# Altium schematic sheet POWR0008_BCR_System.SchDoc: BLUEsat Battery Charge Regulator System
size A3; Engineer: Thomas Fisk; Organization: BLUEsat Project; Address1: Room 419; Address2: School of EE&T; Address3: UNSW, NSW 2052; Address4: Australia; DocumentNumber: POWR0008; SheetNumber: 1; SheetTotal: 1; Description: Controls charging of batteries, MPPT, provides telem data; Version: 2.0
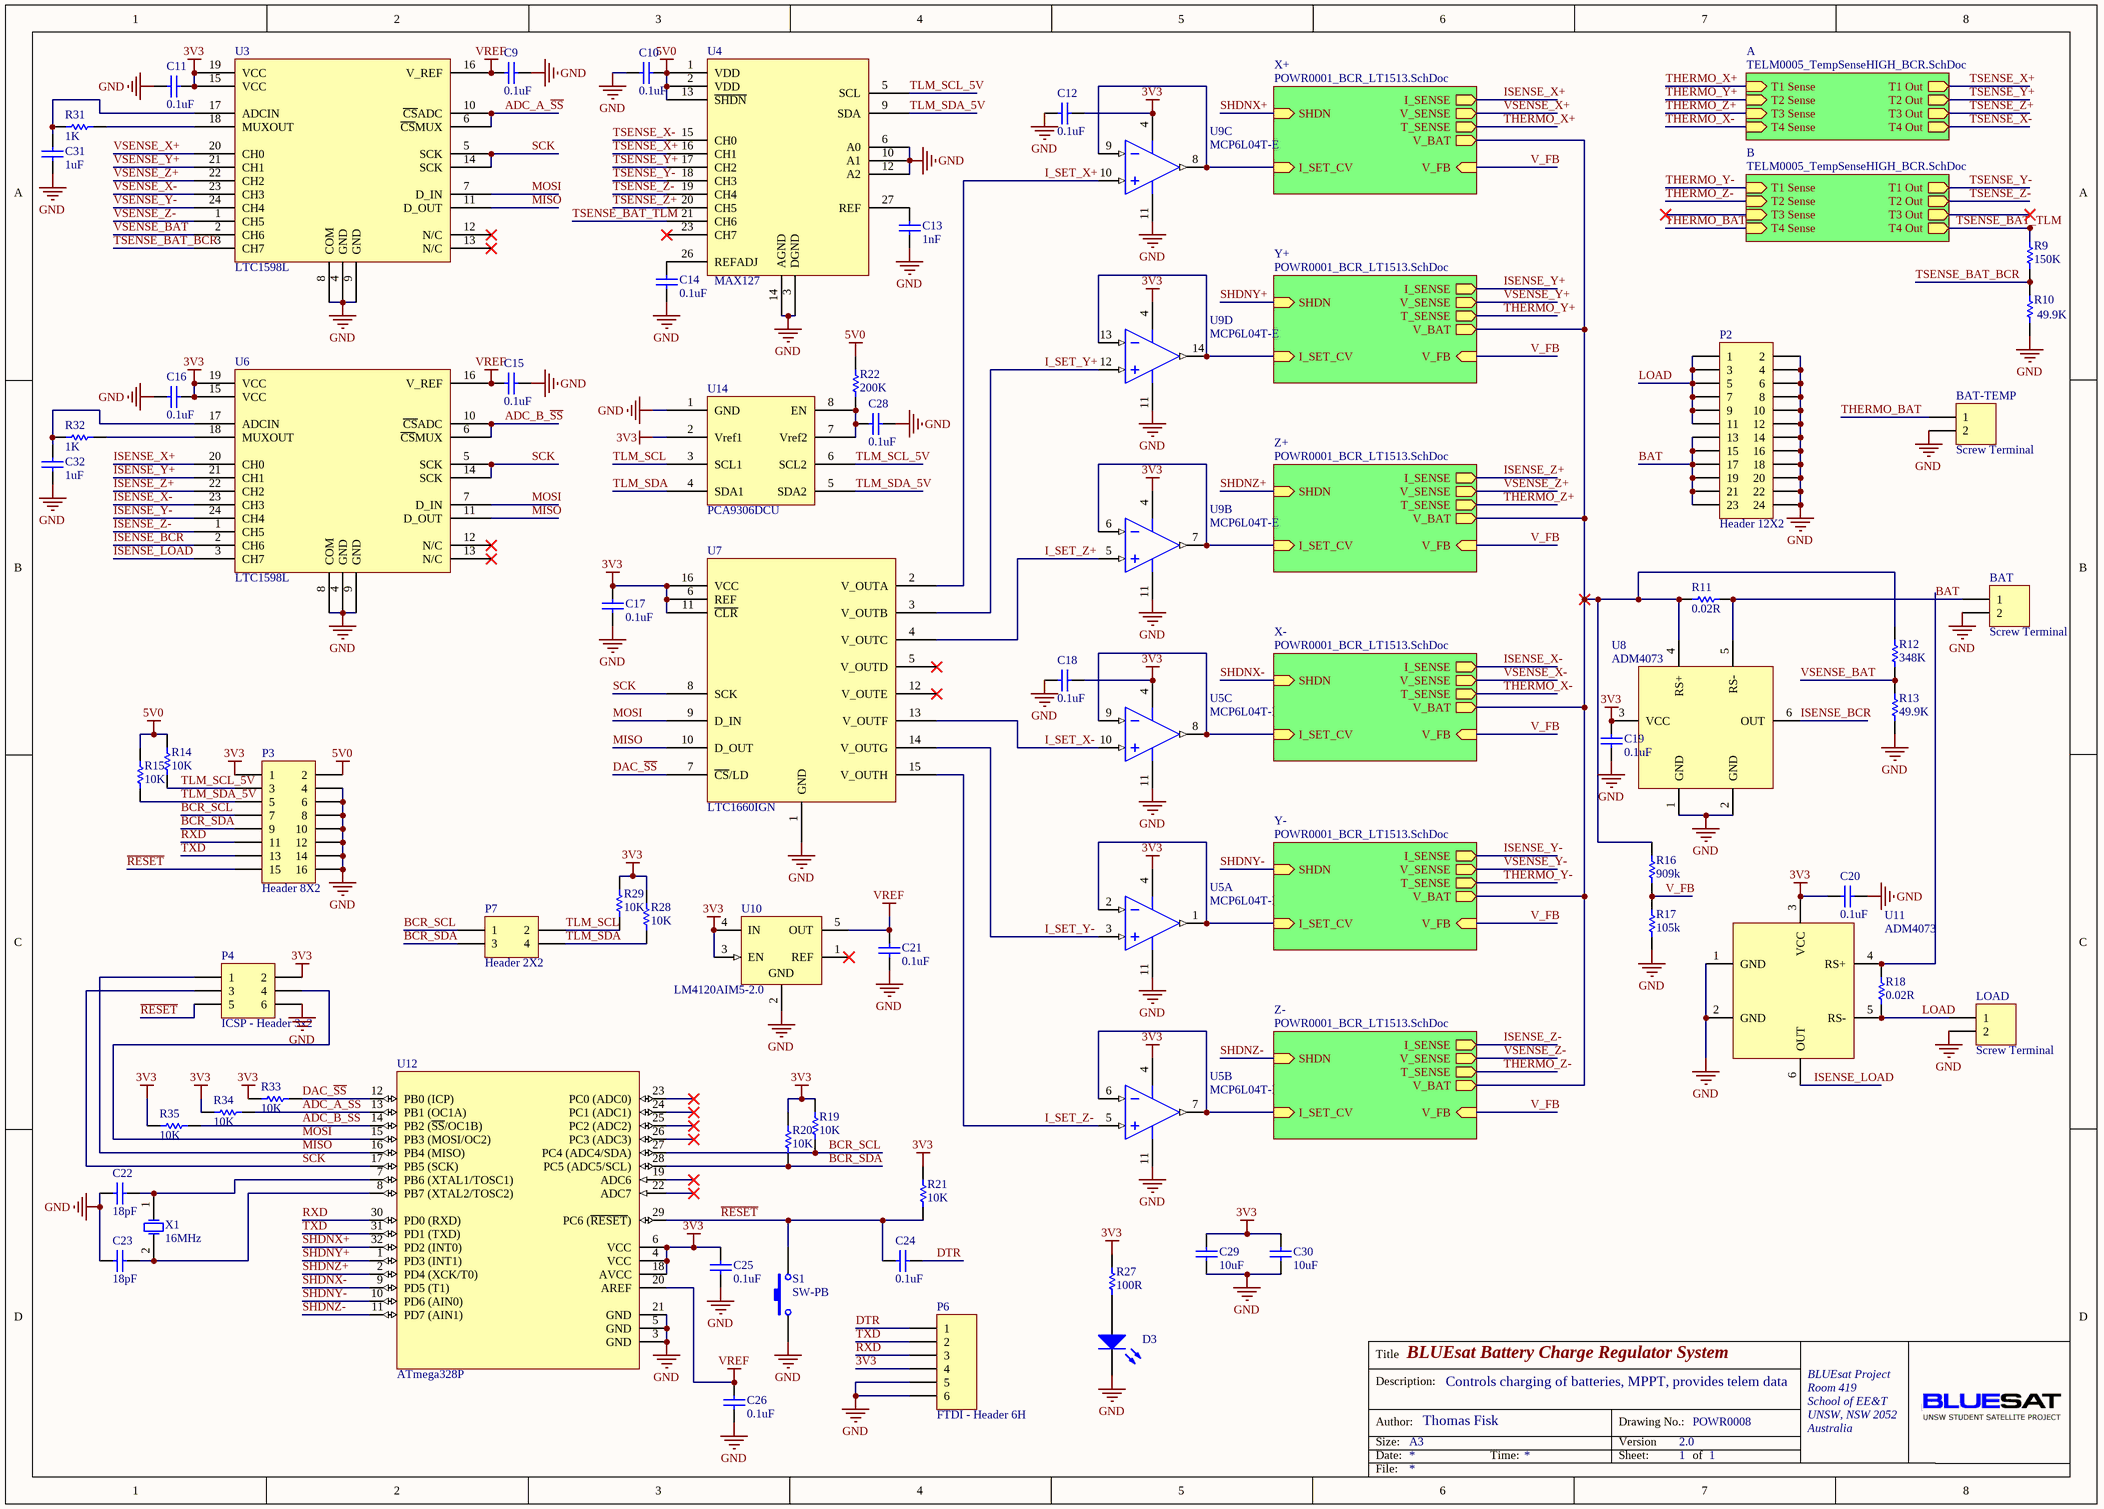
[diagram p0: POWR0008_BCR_System.SchDoc]

## Parts
BAT  Screw Terminal  [5.05mm Terminal Block - 2]
BAT-TEMP  Screw Terminal  [5.05mm Terminal Block - 2]
C9  value 0.1uF  [CAPC2012M]  (hidden comment: Cap)
C10  value 0.1uF  [CAPC2012M]  (hidden comment: Cap)
C11  value 0.1uF  [CAPC2012M]  (hidden comment: Cap)
C12  value 0.1uF  [CAPC2012M]  (hidden comment: Cap)
C13  value 1nF  [CAPC2012M]  (hidden comment: Cap)
C14  value 0.1uF  [CAPC2012M]  (hidden comment: Cap)
C15  value 0.1uF  [CAPC2012M]  (hidden comment: Cap)
C16  value 0.1uF  [CAPC2012M]  (hidden comment: Cap)
C17  value 0.1uF  [CAPC2012M]  (hidden comment: Cap)
C18  value 0.1uF  [CAPC2012M]  (hidden comment: Cap)
C19  value 0.1uF  [CAPC2012M]  (hidden comment: Cap)
C20  value 0.1uF  [CAPC2012M]  (hidden comment: Cap)
C21  value 0.1uF  [CAPC2012M]  (hidden comment: Cap)
C22  value 18pF  [CAPC2012M]  (hidden comment: Cap)
C23  value 18pF  [CAPC2012M]  (hidden comment: Cap)
C24  value 0.1uF  [CAPC2012M]  (hidden comment: Cap)
C25  value 0.1uF  [CAPC2012M]  (hidden comment: Cap)
C26  value 0.1uF  [CAPC2012M]  (hidden comment: Cap)
C28  value 0.1uF  [CAPC2012M]  (hidden comment: Cap)
C29  value 10uF  [CAPC3216M]  (hidden comment: Cap)
C30  value 10uF  [CAPC3216M]  (hidden comment: Cap)
C31  value 1uF  [CAPC2012M]  (hidden comment: Cap)
C32  value 1uF  [CAPC2012M]  (hidden comment: Cap)
D3  0805 LED  [CD2012-0805]  (value not drawn)
LOAD  Screw Terminal  [5.05mm Terminal Block - 2]
P2  Header 12X2  [HDR2X12]
P3  Header 8X2  [HDR2X8]
P4  ICSP - Header 3x2  [HDR2X3]
P6  FTDI - Header 6H  [HDR1X6H]
P7  Header 2X2  [HDR2X2]
R9  value 150K  [RESC2012M]  (hidden comment: Res1)
R10  value 49.9K  [RESC2012M]  (hidden comment: Res1)
R11  value 0.02R  [RESC2012M]  (hidden comment: 0805 Resistor)
R12  value 348K  [RESC2012M]  (hidden comment: Res1)
R13  value 49.9K  [RESC2012M]  (hidden comment: Res1)
R14  value 10K  [RESC2012M]  (hidden comment: Res1)
R15  value 10K  [RESC2012M]  (hidden comment: Res1)
R16  value 909k  [RESC2012M]  (hidden comment: Res1)
R17  value 105k  [RESC2012M]  (hidden comment: Res1)
R18  value 0.02R  [RESC2012M]  (hidden comment: 0805 Resistor)
R19  value 10K  [RESC2012M]  (hidden comment: Res1)
R20  value 10K  [RESC2012M]  (hidden comment: Res1)
R21  value 10K  [RESC2012M]  (hidden comment: Res1)
R22  value 200K  [RESC2012M]  (hidden comment: Res1)
R27  value 100R  [RESC2012M]  (hidden comment: Res1)
R28  value 10K  [RESC2012M]  (hidden comment: Res1)
R29  value 10K  [RESC2012M]  (hidden comment: Res1)
R31  value 1K  [RESC2012M]  (hidden comment: Res1)
R32  value 1K  [RESC2012M]  (hidden comment: Res1)
R33  value 10K  [RESC2012M]  (hidden comment: Res1)
R34  value 10K  [RESC2012M]  (hidden comment: Res1)
R35  value 10K  [RESC2012M]  (hidden comment: Res1)
S1  SW-PB  [RESET SWITCH]
U3  LTC1598L  [LTC1598L]
U4  MAX127  [SSOP28 - MAX127]
U5  MCP6L04T-E  [MTC14_N]  (parts A,B,C of 4)
U6  LTC1598L  [LTC1598L]
U7  LTC1660IGN  [LTC1660]
U8  ADM4073  [SOT95P285X145-6N]
U9  MCP6L04T-E  [MTC14_N]  (parts B,C,D of 4)
U10  LM4120AIM5-2.0  [MF05A_N]
U11  ADM4073  [SOT95P285X145-6N]
U12  ATmega328P  [32A_N]
U14  PCA9306DCU  [TSSOP50P310X90-8N]
X1  16MHz  [HC49 - No border]

## Sub-sheets
A = TELM0005_TempSenseHIGH_BCR.SchDoc: T1 Sense (in), T2 Sense (in), T3 Sense (in), T4 Sense (in), T1 Out (out), T2 Out (out), T3 Out (out), T4 Out (out)
B = TELM0005_TempSenseHIGH_BCR.SchDoc: T1 Sense (in), T2 Sense (in), T3 Sense (in), T4 Sense (in), T1 Out (out), T2 Out (out), T3 Out (out), T4 Out (out)
X+ = POWR0001_BCR_LT1513.SchDoc: I_SET_CV (in), V_BAT (out), SHDN (in), V_FB (in), V_SENSE (out), T_SENSE (out), I_SENSE (out)
X- = POWR0001_BCR_LT1513.SchDoc: I_SET_CV (in), V_BAT (out), SHDN (in), V_FB (in), V_SENSE (out), T_SENSE (out), I_SENSE (out)
Y+ = POWR0001_BCR_LT1513.SchDoc: I_SET_CV (in), V_BAT (out), SHDN (in), V_FB (in), V_SENSE (out), T_SENSE (out), I_SENSE (out)
Y- = POWR0001_BCR_LT1513.SchDoc: I_SET_CV (in), V_BAT (out), SHDN (in), V_FB (in), V_SENSE (out), T_SENSE (out), I_SENSE (out)
Z+ = POWR0001_BCR_LT1513.SchDoc: I_SET_CV (in), V_BAT (out), SHDN (in), V_FB (in), V_SENSE (out), T_SENSE (out), I_SENSE (out)
Z- = POWR0001_BCR_LT1513.SchDoc: I_SET_CV (in), V_BAT (out), SHDN (in), V_FB (in), V_SENSE (out), T_SENSE (out), I_SENSE (out)

## Nets
3V3: C11.2 C12.2 C16.2 C17.2 C18.2 C19.1 C20.1 C25.2 C29.2 C30.2 P3.1 P4.2 P6.4 R19.1 R20.1 R21.1 R27.1 R28.2 R29.2 R33.1 R34.1 R35.1 U3.15(VCC) U3.19(VCC) U5.4(V+) U6.15(VCC) U6.19(VCC) U7.6(REF) U7.11(~{CLR}) U7.16(VCC) U8.3(VCC) U9.4(V+) U10.3(EN) U10.4(IN) U11.3(VCC) U12.4(VCC) U12.6(VCC) U12.18(AVCC) U14.2(Vref1)
5V0: C10.2 P3.2 R14.1 R15.1 R22.1 U4.1(VDD) U4.2(VDD) U4.13(~{SHDN})
GND: BAT.2 BAT-TEMP.2 C9.1 C10.1 C11.1 C12.1 C13.2 C14.1 C15.1 C16.1 C17.1 C18.1 C19.2 C20.2 C21.1 C22.1 C23.1 C25.1 C26.2 C28.1 C29.1 C30.1 C31.1 C32.1 D3.2(K) LOAD.2 P2.2 P2.4 P2.6 P2.8 P2.10 P2.12 P2.14 P2.16 P2.18 P2.20 P2.22 P2.24 P3.4 P3.6 P3.8 P3.10 P3.12 P3.14 P3.16 P4.6 P6.5 P6.6 R10.2 R13.2 R17.1 S1.1 U3.4(GND) U3.8(COM) U3.9(GND) U4.3(DGND) U4.6(A0) U4.10(A1) U4.12(A2) U4.14(AGND) U5.11(V-) U6.4(GND) U6.8(COM) U6.9(GND) U7.1(GND) U8.1(GND) U8.2(GND) U9.11(V-) U10.2(GND) U11.1(GND) U11.2(GND) U12.3(GND) U12.5(GND) U12.21(GND) U14.1(GND)
VREF: C9.2 C15.2 C21.2 C26.1 U3.16(V_REF) U6.16(V_REF) U10.5(OUT) U12.20(AREF)
ADC_A_~{SS}: R34.2 U3.6(~{CS}MUX) U3.10(~{CS}ADC) U12.13(PB1_(OC1A))
ADC_B_~{SS}: R35.2 U6.6(~{CS}MUX) U6.10(~{CS}ADC) U12.14(PB2_(~{SS}/OC1B))
BAT: BAT.1 P2.13 P2.15 P2.17 P2.19 P2.21 P2.23 R11.2 R18.2 U8.5(RS-) U11.4(RS+)
BCR_SCL: P3.7 P7.1 R19.2 U12.27(PC4_(ADC4/SDA))
BCR_SDA: P3.9 P7.3 R20.2 U12.28(PC5_(ADC5/SCL))
DAC_~{SS}: R33.2 U7.7(~{CS}/LD) U12.12(PB0_(ICP))
DTR: C24.1 P6.1
I_SET_X+: U7.2(V_OUTA) U9.10(INC+)
I_SET_X-: U5.10(INC+) U7.13(V_OUTF)
I_SET_Y+: U7.3(V_OUTB) U9.12(IND+)
I_SET_Y-: U5.3(INA+) U7.14(V_OUTG)
I_SET_Z+: U7.4(V_OUTC) U9.5(INB+)
I_SET_Z-: U5.5(INB+) U7.15(V_OUTH)
ISENSE_BCR: U6.2(CH6) U8.6(OUT)
ISENSE_LOAD: U6.3(CH7) U11.6(OUT)
ISENSE_X+: U6.20(CH0) ; sheet X+/I_SENSE
ISENSE_X-: U6.23(CH3) ; sheet X-/I_SENSE
ISENSE_Y+: U6.21(CH1) ; sheet Y+/I_SENSE
ISENSE_Y-: U6.24(CH4) ; sheet Y-/I_SENSE
ISENSE_Z+: U6.22(CH2) ; sheet Z+/I_SENSE
ISENSE_Z-: U6.1(CH5) ; sheet Z-/I_SENSE
LOAD: LOAD.1 P2.1 P2.3 P2.5 P2.7 P2.9 P2.11 R18.1 U11.5(RS-)
MISO: P4.1 U3.11(D_OUT) U6.11(D_OUT) U7.10(D_OUT) U12.16(PB4_(MISO))
MOSI: P4.4 U3.7(D_IN) U6.7(D_IN) U7.9(D_IN) U12.15(PB3_(MOSI/OC2))
~{RESET}: C24.2 P3.15 P4.5 R21.2 S1.2 U12.29(PC6_(~{RESET}))
RXD: P3.11 P6.3 U12.30(PD0_(RXD))
SCK: P4.3 U3.5(SCK) U3.14(SCK) U6.5(SCK) U6.14(SCK) U7.8(SCK) U12.17(PB5_(SCK))
SHDNX+: U12.32(PD2_(INT0)) ; sheet X+/SHDN
SHDNX-: U12.9(PD5_(T1)) ; sheet X-/SHDN
SHDNY+: U12.1(PD3_(INT1)) ; sheet Y+/SHDN
SHDNY-: U12.10(PD6_(AIN0)) ; sheet Y-/SHDN
SHDNZ+: U12.2(PD4_(XCK/T0)) ; sheet Z+/SHDN
SHDNZ-: U12.11(PD7_(AIN1)) ; sheet Z-/SHDN
THERMO_BAT: BAT-TEMP.1 ; sheet B/T4 Sense
THERMO_X+: sheet X+/T_SENSE, sheet A/T1 Sense
THERMO_X-: sheet X-/T_SENSE, sheet A/T4 Sense
THERMO_Y+: sheet Y+/T_SENSE, sheet A/T2 Sense
THERMO_Y-: sheet Y-/T_SENSE, sheet B/T1 Sense
THERMO_Z+: sheet Z+/T_SENSE, sheet A/T3 Sense
THERMO_Z-: sheet Z-/T_SENSE, sheet B/T2 Sense
TLM_SCL: P7.2 R29.1 U14.3(SCL1)
TLM_SCL_5V: P3.3 R14.2 U4.5(SCL) U14.6(SCL2)
TLM_SDA: P7.4 R28.1 U14.4(SDA1)
TLM_SDA_5V: P3.5 R15.2 U4.9(SDA) U14.5(SDA2)
TSENSE_BAT_BCR: R9.1 R10.1 U3.3(CH7)
TSENSE_BAT_TLM: R9.2 U4.21(CH6) ; sheet B/T4 Out
TSENSE_X+: U4.16(CH1) ; sheet A/T1 Out
TSENSE_X-: U4.15(CH0) ; sheet A/T4 Out
TSENSE_Y+: U4.17(CH2) ; sheet A/T2 Out
TSENSE_Y-: U4.18(CH3) ; sheet B/T1 Out
TSENSE_Z+: U4.20(CH5) ; sheet A/T3 Out
TSENSE_Z-: U4.19(CH4) ; sheet B/T2 Out
TXD: P3.13 P6.2 U12.31(PD1_(TXD))
V_FB: R16.1 R17.2 ; sheet X+/V_FB, sheet Y+/V_FB, sheet Z+/V_FB, sheet X-/V_FB, sheet Y-/V_FB, sheet Z-/V_FB
VSENSE_BAT: R12.2 R13.1 U3.2(CH6)
VSENSE_X+: U3.20(CH0) ; sheet X+/V_SENSE
VSENSE_X-: U3.23(CH3) ; sheet X-/V_SENSE
VSENSE_Y+: U3.21(CH1) ; sheet Y+/V_SENSE
VSENSE_Y-: U3.24(CH4) ; sheet Y-/V_SENSE
VSENSE_Z+: U3.22(CH2) ; sheet Z+/V_SENSE
VSENSE_Z-: U3.1(CH5) ; sheet Z-/V_SENSE
NetC13_1: C13.1 U4.27(REF)
NetC14_2: C14.2 U4.26(REFADJ)
NetC22_2: C22.2 U12.7(PB6_(XTAL1/TOSC1)) X1.1(OSC1)
NetC23_2: C23.2 U12.8(PB7_(XTAL2/TOSC2)) X1.2(OSC2)
NetC28_2: C28.2 R22.2 U14.7(Vref2) U14.8(EN)
NetC31_2: C31.2 R31.2 U3.17(ADCIN)
NetC32_2: C32.2 R32.2 U6.17(ADCIN)
NetD3_1: D3.1(A) R27.2
NetR11_1: R11.1 R12.1 R16.2 U8.4(RS+) ; sheet X+/V_BAT, sheet Y+/V_BAT, sheet Z+/V_BAT, sheet X-/V_BAT, sheet Y-/V_BAT, sheet Z-/V_BAT
NetR31_1: R31.1 U3.18(MUXOUT)
NetR32_1: R32.1 U6.18(MUXOUT)
NetU5_1: U5.1(OUTA) U5.2(INA-) ; sheet Y-/I_SET_CV
NetU5_6: U5.6(INB-) U5.7(OUTB) ; sheet Z-/I_SET_CV
NetU5_8: U5.8(OUTC) U5.9(INC-) ; sheet X-/I_SET_CV
NetU9_6: U9.6(INB-) U9.7(OUTB) ; sheet Z+/I_SET_CV
NetU9_8: U9.8(OUTC) U9.9(INC-) ; sheet X+/I_SET_CV
NetU9_13: U9.13(IND-) U9.14(OUTD) ; sheet Y+/I_SET_CV

Not connected (* = marked no-connect by the designer): U3 12(N/C)* 13(N/C)*; U4 23(CH7)*; U6 12(N/C)* 13(N/C)*; U7 5(V_OUTD)* 12(V_OUTE)*; U10 1(REF)*; U12 19(ADC6)* 22(ADC7)* 23(PC0_(ADC0))* 24(PC1_(ADC1))* 25(PC2_(ADC2))* 26(PC3_(ADC3))*

## Notes on the sheet
- Title
- Description:
- Size:
- Author:
- Date:
- A3
- Time:
- Version
- Sheet:
- Drawing No.:
- of
- File:

## Library data of the parts
BAT BAT-TEMP LOAD = Header 2: Header, 2-Pin; LatestRevisionDate: 17-Jul-2002; LatestRevisionNote: Re-released for DXP Platform.; Publisher: Altium Limited
C9-C26 C28-C32 = Cap: Capacitor; Published: 8-Jun-2000; LatestRevisionDate: 17-Jul-2002; LatestRevisionNote: Re-released for DXP Platform.; PackageReference: RAD-0.3; Publisher: Altium Limited; PackageDescription: Radial Cap, Thru-Hole; 2 Leads; 0.3 in Pin Spacing; Supplier 1: Farnell; Supplier 2: Farnell; Supplier Part Number 2: 1759265
D3 = LED2: Typical RED, GREEN, YELLOW, AMBER GaAs LED; Published: 8-Jun-2000; LatestRevisionDate: 17-Jul-2002; LatestRevisionNote: Re-released for DXP Platform.; PackageVersion: Feb-2002; PackageReference: 3.2X1.6X1.1; Publisher: Altium Limited; PackageDescription: SM LED; 2 Flat Leads
P2 = Header 12X2: Header, 12-Pin, Dual row; LatestRevisionDate: 17-Jul-2002; LatestRevisionNote: Re-released for DXP Platform.; Publisher: Altium Limited
P3 = Header 8X2: Header, 8-Pin, Dual row; LatestRevisionDate: 17-Jul-2002; LatestRevisionNote: Re-released for DXP Platform.; Publisher: Altium Limited
P4 = Header 3X2: Header, 3-Pin, Dual row; LatestRevisionDate: 17-Jul-2002; LatestRevisionNote: Re-released for DXP Platform.; Publisher: Altium Limited
P6 = Header 6H: Header, 6-Pin, Right Angle; LatestRevisionDate: 17-Jul-2002; LatestRevisionNote: Re-released for DXP Platform.; Publisher: Altium Limited
P7 = Header 2X2: Header, 2-Pin, Dual row; LatestRevisionDate: 17-Jul-2002; LatestRevisionNote: Re-released for DXP Platform.; Publisher: Altium Limited
R9-R22 R27-R29 R31-R35 = Res1: Resistor; Published: 8-Jun-2000; LatestRevisionDate: 17-Jul-2002; LatestRevisionNote: Re-released for DXP Platform.; PackageReference: AXIAL-0.3; Publisher: Altium Limited; PackageDescription: Axial Device, Thru-Hole; 2 Leads; 0.3 in Pin Spacing; Supplier 1: Farnell
S1 = SW-PB: Switch; Published: 24-Mar-1999; LatestRevisionDate: 17-Jul-2002; LatestRevisionNote: Re-released for DXP Platform.; PackageReference: SPST-2; Publisher: Altium Limited; PackageDescription: Switch; 2 Leads
U4 = MAX127: 8 Channel, 12 bit, I2C DAS
U5 U9 = LMV554MT: 3 MHz, Micropower RRO Amplifier; Manufacturer: National Semiconductor; CompType: Amplifiers; PackageTopMarking: NSUZXYTT*LMV55*4MT; PowerWise: Y; Published: 4-Dec-2008; LatestRevisionDate: 13-Jan-2009; LatestRevisionNote: Sim Model Added.; DatasheetVersion: Aug-2008; PackageVersion: revD, Jun-2003; PackageReference: MTC14; Publisher: Altium Limited; PackageDescription: Molded TSSOP, JEDEC, 5 x 4.4 x 0.9mm Body, 14 Lead, 0.65mm Pitch; PartNumber: LMV554MT; RoHS: Y; PinCount: 14; DigiKeyPartNumber: LMV554MT-ND; Code_JEDEC: MO-153-AB-1; ComponentLink1Description: LMV554 Datasheet; ComponentLink1URL: http://www.national.com/ds/LM/LMV554.pdf; ComponentLink2Description: LMV554 Web Page; ComponentLink2URL: http://www.national.com/pf/LM/LMV554.html; ComponentLink3Description: MTC14 Package Page; ComponentLink3URL: http://www.national.com/packaging/folders/mtc14.html
U8 U11 = ADM4073: Current Sense Amplifer
U10 = LM4120AIM5-2.0: Precision Micropower Low Dropout Voltage Reference; Manufacturer: National Semiconductor; CompType: Voltage Reference IC; PackageTopMarking: R14A*XTT; PowerWise: Y; Published: 4-Dec-2008; DatasheetVersion: Mar-2005; PackageVersion: revD, Aug-2008; PackageReference: MF05A; Publisher: Altium Limited; PackageDescription: Molded SOT-23, .115 x .063 x .040 in Body, 5 Lead, .0375 in Pitch; PartNumber: LM4120AIM5-2.0; RoHS: O; PinCount: 5; DigiKeyPartNumber: LM4120AIM5-2.0CT-ND; ComponentLink1Description: LM4120 Datasheet; ComponentLink1URL: http://www.national.com/ds/LM/LM4120.pdf; ComponentLink2Description: LM4120 Web Page; ComponentLink2URL: http://www.national.com/pf/LM/LM4120.html; ComponentLink3Description: MF05A Package Page; ComponentLink3URL: http://www.national.com/packaging/folders/mf05a.html
U12 = ATmega8-16AC: 8-Bit AVR Microcontroller with 8K Bytes of In-System Programmable Flash Memory; Published: 17-Sep-2003; LatestRevisionDate: 13-Apr-2006; LatestRevisionNote: IPC-7351 Footprint Added.; DatasheetVersion: 2486H-AVR-09/02; PackageVersion: revB, Oct-2001; PackageReference: 32A; Publisher: Altium Limited; PackageDescription: 32-Pin Thin Quad Flat Pack 0.8 mm Pitch; Code_JEDEC: MS-026-ABA; ComponentLink1Description: Manufacturer Link; ComponentLink1URL: http://www.atmel.com; ComponentLink2Description: Datasheet; ComponentLink2URL: http://www.atmel.com/dyn/resources/prod_documents/doc2486.pdf
U14 = PCA9306
X1 = ECS-110-S-5P: Crystal Oscillator; Published: 17-Jul-2002; DatasheetDocument: 18-Apr-2000; PackageReference: CSM-7; Publisher: Altium Limited; ComponentLink1Description: Manufacturer Link; ComponentLink1URL: http://www.ecsxtal.com/; ComponentLink2Description: Datasheet; ComponentLink2URL: http://www.ecsxtal.com/pdf3/CSM_7.pdf